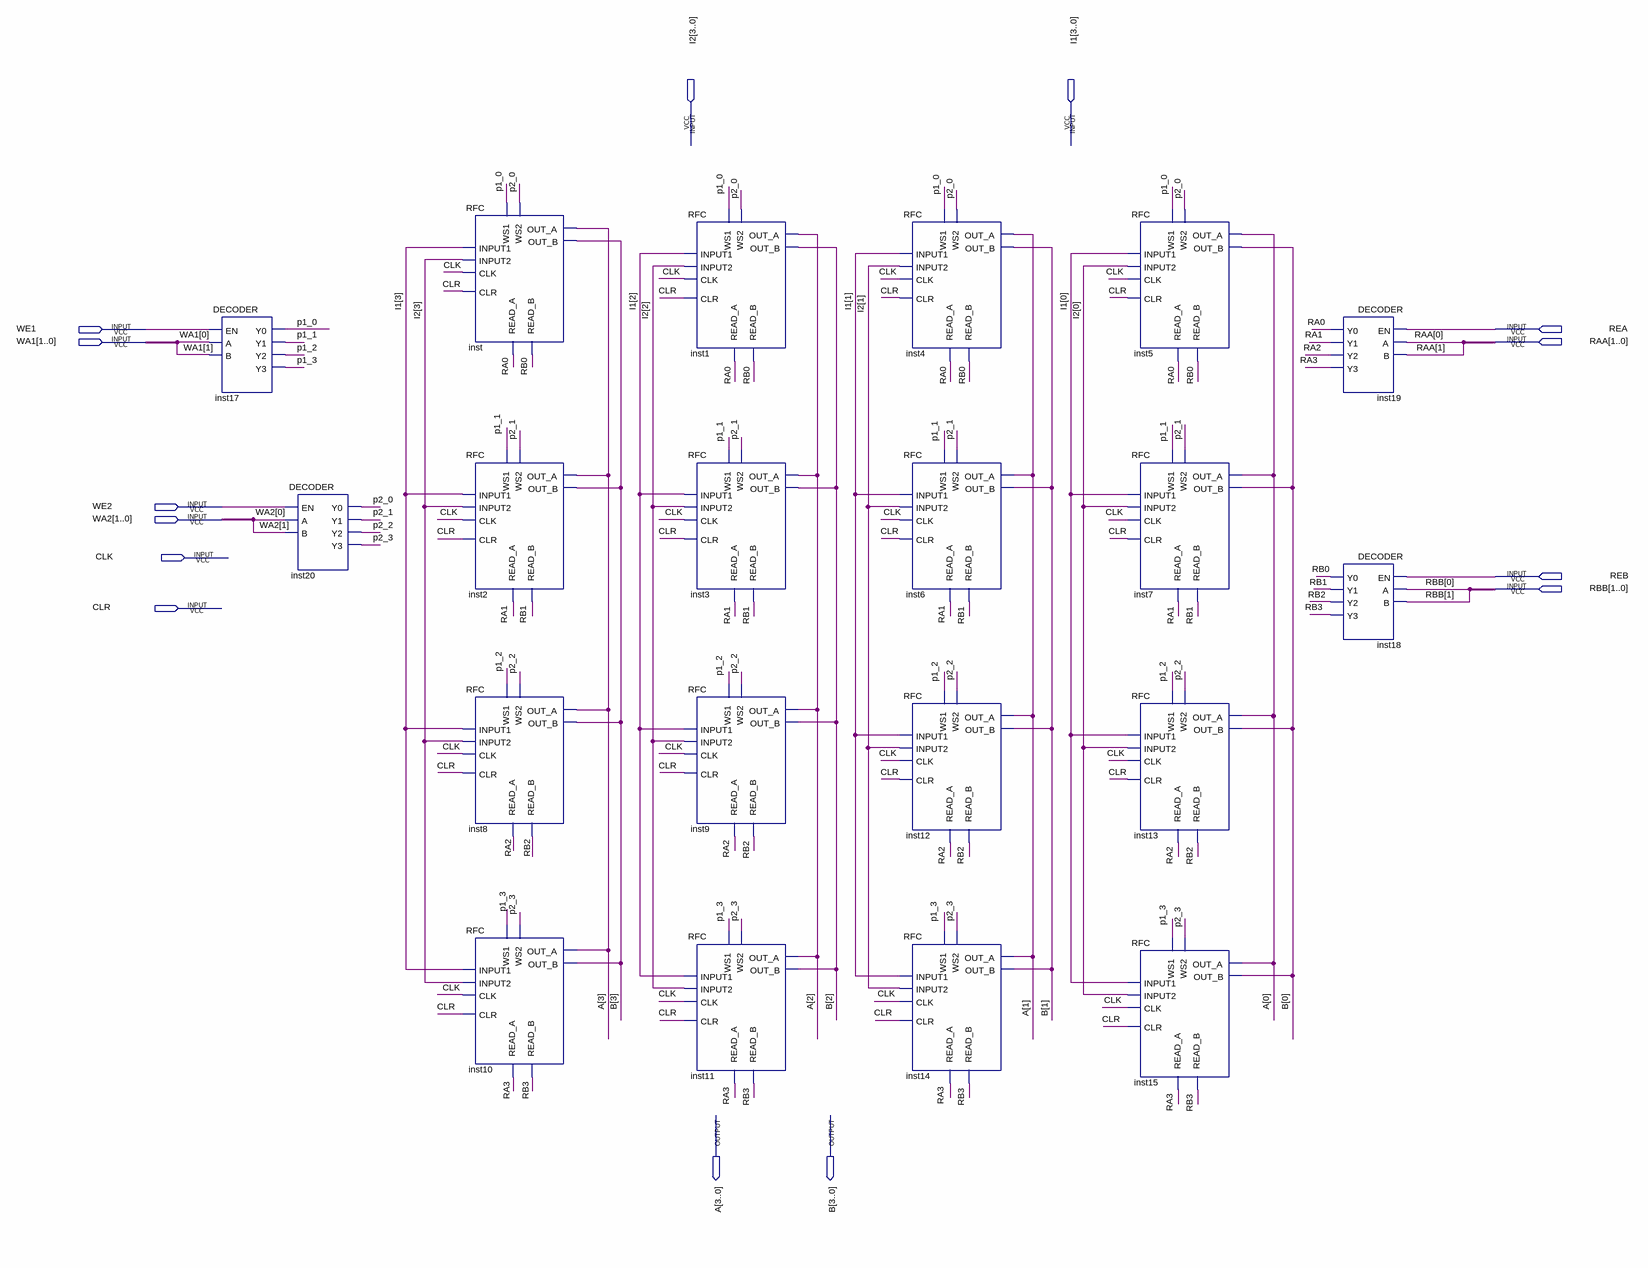
[diagram p0: schematic sheet]
// Quartus schematic RF.bdf as structural Verilog: 20 symbols, 14 pins
module RF (
  input  [3:0] I2,
  input  [3:0] I1,
  input  WE1,
  input  REA,
  input  [1:0] WA1,
  input  [1:0] RAA,
  input  WE2,
  input  [1:0] WA2,
  input  CLK,
  input  REB,
  input  [1:0] RBB,
  input  CLR,
  output [3:0] A,
  output [3:0] B
);

  wire p1_0, p1_1, p1_2, p1_3, p2_0, p2_1, p2_2, p2_3, RA0, RA1, RA2, RA3, RB0, RB1, RB2, RB3;

  DECODER inst17 (.EN(WE1), .A(WA1[0]), .B(WA1[1]), .Y0(p1_0), .Y1(p1_1), .Y2(p1_2), .Y3(p1_3));
  DECODER inst20 (.EN(WE2), .A(WA2[0]), .B(WA2[1]), .Y0(p2_0), .Y1(p2_1), .Y2(p2_2), .Y3(p2_3));
  RFC inst (
    .INPUT1(I1[3]), .INPUT2(I2[3]), .WS1(p1_0), .WS2(p2_0), .CLK(CLK), .CLR(CLR), .READ_A(RA0), .READ_B(RB0),
    .OUT_A(A[3]), .OUT_B(B[3]));
  RFC inst2 (
    .INPUT1(I1[3]), .INPUT2(I2[3]), .WS1(p1_1), .WS2(p2_1), .CLK(CLK), .CLR(CLR), .READ_A(RA1), .READ_B(RB1),
    .OUT_A(A[3]), .OUT_B(B[3]));
  RFC inst8 (
    .INPUT1(I1[3]), .INPUT2(I2[3]), .WS1(p1_2), .WS2(p2_2), .CLK(CLK), .CLR(CLR), .READ_A(RA2), .READ_B(RB2),
    .OUT_A(A[3]), .OUT_B(B[3]));
  RFC inst10 (
    .INPUT1(I1[3]), .INPUT2(I2[3]), .WS1(p1_3), .WS2(p2_3), .CLK(CLK), .CLR(CLR), .READ_A(RA3), .READ_B(RB3),
    .OUT_A(A[3]), .OUT_B(B[3]));
  RFC inst1 (
    .INPUT1(I1[2]), .INPUT2(I2[2]), .WS1(p1_0), .WS2(p2_0), .CLK(CLK), .CLR(CLR), .READ_A(RA0), .READ_B(RB0),
    .OUT_A(A[2]), .OUT_B(B[2]));
  RFC inst3 (
    .INPUT1(I1[2]), .INPUT2(I2[2]), .WS1(p1_1), .WS2(p2_1), .CLK(CLK), .CLR(CLR), .READ_A(RA1), .READ_B(RB1),
    .OUT_A(A[2]), .OUT_B(B[2]));
  RFC inst9 (
    .INPUT1(I1[2]), .INPUT2(I2[2]), .WS1(p1_2), .WS2(p2_2), .CLK(CLK), .CLR(CLR), .READ_A(RA2), .READ_B(RB2),
    .OUT_A(A[2]), .OUT_B(B[2]));
  RFC inst11 (
    .INPUT1(I1[2]), .INPUT2(I2[2]), .WS1(p1_3), .WS2(p2_3), .CLK(CLK), .CLR(CLR), .READ_A(RA3), .READ_B(RB3),
    .OUT_A(A[2]), .OUT_B(B[2]));
  RFC inst4 (
    .INPUT1(I1[1]), .INPUT2(I2[1]), .WS1(p1_0), .WS2(p2_0), .CLK(CLK), .CLR(CLR), .READ_A(RA0), .READ_B(RB0),
    .OUT_A(A[1]), .OUT_B(B[1]));
  RFC inst6 (
    .INPUT1(I1[1]), .INPUT2(I2[1]), .WS1(p1_1), .WS2(p2_1), .CLK(CLK), .CLR(CLR), .READ_A(RA1), .READ_B(RB1),
    .OUT_A(A[1]), .OUT_B(B[1]));
  RFC inst12 (
    .INPUT1(I1[1]), .INPUT2(I2[1]), .WS1(p1_2), .WS2(p2_2), .CLK(CLK), .CLR(CLR), .READ_A(RA2), .READ_B(RB2),
    .OUT_A(A[1]), .OUT_B(B[1]));
  RFC inst14 (
    .INPUT1(I1[1]), .INPUT2(I2[1]), .WS1(p1_3), .WS2(p2_3), .CLK(CLK), .CLR(CLR), .READ_A(RA3), .READ_B(RB3),
    .OUT_A(A[1]), .OUT_B(B[1]));
  RFC inst5 (
    .INPUT1(I1[0]), .INPUT2(I2[0]), .WS1(p1_0), .WS2(p2_0), .CLK(CLK), .CLR(CLR), .READ_A(RA0), .READ_B(RB0),
    .OUT_A(A[0]), .OUT_B(B[0]));
  RFC inst7 (
    .INPUT1(I1[0]), .INPUT2(I2[0]), .WS1(p1_1), .WS2(p2_1), .CLK(CLK), .CLR(CLR), .READ_A(RA1), .READ_B(RB1),
    .OUT_A(A[0]), .OUT_B(B[0]));
  RFC inst13 (
    .INPUT1(I1[0]), .INPUT2(I2[0]), .WS1(p1_2), .WS2(p2_2), .CLK(CLK), .CLR(CLR), .READ_A(RA2), .READ_B(RB2),
    .OUT_A(A[0]), .OUT_B(B[0]));
  RFC inst15 (
    .INPUT1(I1[0]), .INPUT2(I2[0]), .WS1(p1_3), .WS2(p2_3), .CLK(CLK), .CLR(CLR), .READ_A(RA3), .READ_B(RB3),
    .OUT_A(A[0]), .OUT_B(B[0]));
  DECODER inst19 (.EN(REA), .A(RAA[0]), .B(RAA[1]), .Y0(RA0), .Y1(RA1), .Y2(RA2), .Y3(RA3));
  DECODER inst18 (.EN(REB), .A(RBB[0]), .B(RBB[1]), .Y0(RB0), .Y1(RB1), .Y2(RB2), .Y3(RB3));
endmodule
